# EAGLE schematic Esp_4relay_feedback (EAGLE 6.1)

## Sheet 1 of 3
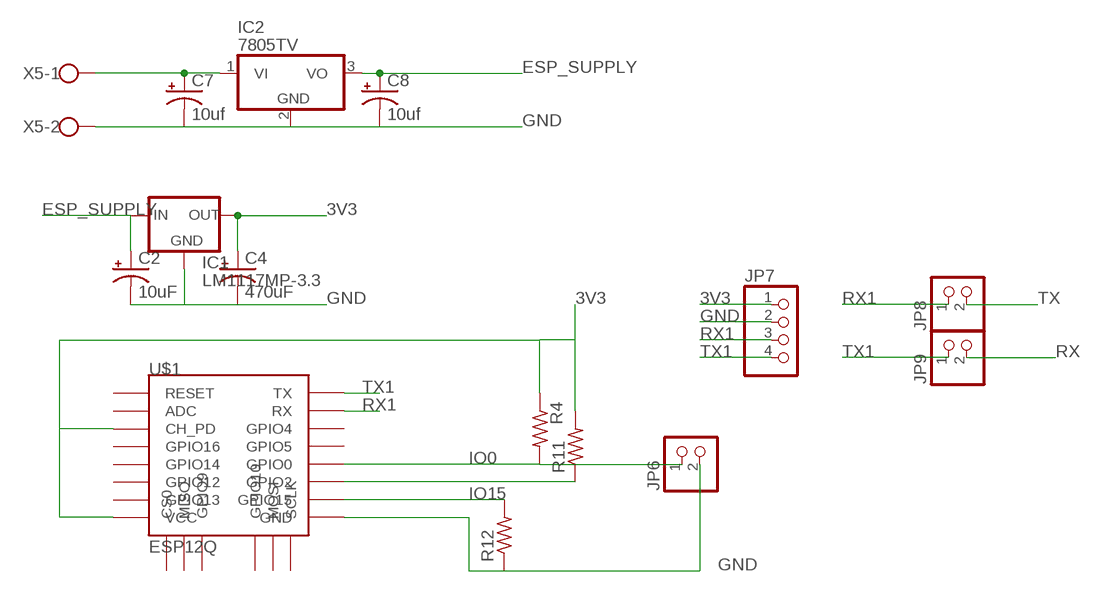
[diagram p0: schematic, sheet 1]

### Parts
C2  10uF  CPOL-USE2.5-6  [E2,5-6]
C4  470uF  CPOL-USE5-8.5  [E5-8,5]
C7  10uf  CPOL-USE2.5-6  [E2,5-6]
C8  10uf  CPOL-USE2.5-6  [E2,5-6]
IC1  LM1117MP-3.3  [SOT223]
IC2  7805TV  [TO220V]
JP6  PINHD-1X2  [1X02]
JP7  PINHD-1X4  [1X04]
JP8  PINHD-1X2  [1X02]
JP9  PINHD-1X2  [1X02]
R4  R-US_0207/10  [0207/10]
R11  R-US_0207/10  [0207/10]
R12  R-US_0207/10  [0207/10]
U$1  ESP12Q  [ESP12Q]
X5  W237-102  [W237-102]

### Nets
3V3: C4.+ IC1.2(OUT) IC1.4(OUT) JP7.1 R4.1 R11.2 U$1.CH_PD U$1.VCC
ESP_SUPPLY: C2.+ C8.+ IC1.3(IN) IC2.3(VO)
GND: C2.- C4.- C7.- C8.- IC1.1(GND) IC2.2(GND) JP6.2 JP7.2 R12.1 U$1.GND X5.2 ; also sheet 2,3
IO0: JP6.1 R4.2 U$1.GPIO0
IO15: R12.2 U$1.GPIO15
N$21: R11.1 U$1.GPIO2
N$26: C7.+ IC2.1(VI) X5.1
RX: JP9.2 ; also sheet 2
RX1: JP7.3 JP8.1 U$1.RX
TX: JP8.2 ; also sheet 2
TX1: JP7.4 JP9.1 U$1.TX
Unconnected: U$1.ADC U$1.CS0 U$1.GPIO4 U$1.GPIO5 U$1.GPIO9 U$1.GPIO10 U$1.GPIO12 U$1.GPIO13 U$1.GPIO14 U$1.GPIO16 U$1.MISO U$1.MOSI U$1.RESET U$1.SCLK

## Sheet 2 of 3
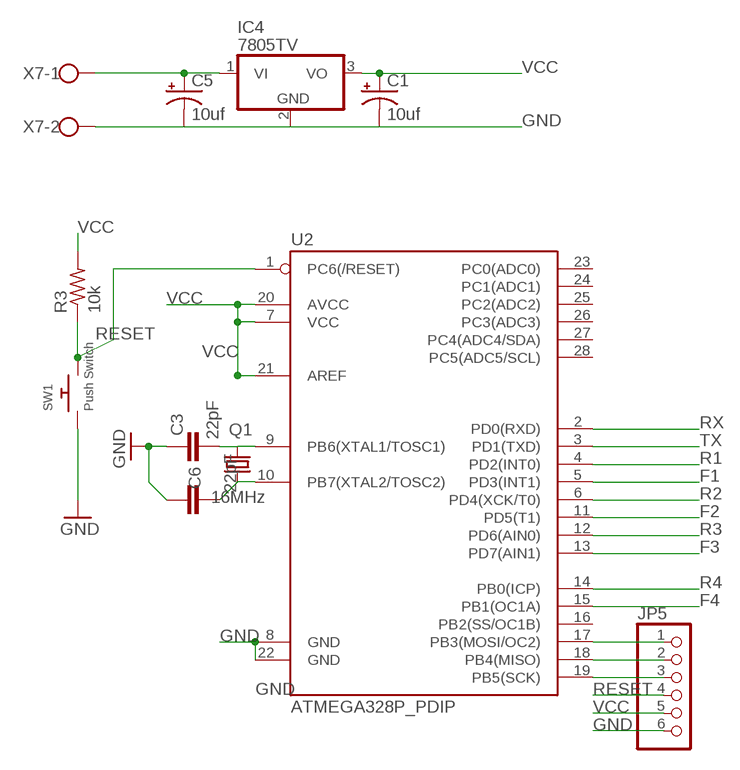
[diagram p1: schematic, sheet 2]

### Parts
C1  10uf  CPOL-USE2.5-6  [E2,5-6]
C3  22pF  CAPPTH  [CAP-PTH-SMALL]
C5  10uf  CPOL-USE2.5-6  [E2,5-6]
C6  22pF  CAPPTH  [CAP-PTH-SMALL]
IC4  7805TV  [TO220V]
JP5  PINHD-1X6  [1X06]
Q1  16MHz  CRYSTALHC49US  [HC49US]
R3  10k  R-US_0207/10  [0207/10]
SW1  Push Switch  SWITCH_PUSHBUTTONEVQ-PE  [TACT_PANA-EVQ]
U2  ATMEGA328P_PDIP  [DIL28-3]
X7  W237-102  [W237-102]

### Nets
F1: U2.5(PD3(INT1)) ; also sheet 3
F2: U2.11(PD5(T1)) ; also sheet 3
F3: U2.13(PD7(AIN1)) ; also sheet 3
F4: U2.15(PB1(OC1A)) ; also sheet 3
GND: C1.- C3.1 C5.- C6.1 IC4.2(GND) JP5.6 SW1.P$1 U2.8(GND) U2.22(GND) X7.2 ; also sheet 1,3
N$5: C3.2 Q1.2 U2.9(PB6(XTAL1/TOSC1))
N$10: C6.2 Q1.1 U2.10(PB7(XTAL2/TOSC2))
N$16: JP5.3 U2.19(PB5(SCK))
N$23: JP5.2 U2.18(PB4(MISO))
N$32: JP5.1 U2.17(PB3(MOSI/OC2))
N$33: C5.+ IC4.1(VI) X7.1
R1: U2.4(PD2(INT0)) ; also sheet 3
R2: U2.6(PD4(XCK/T0)) ; also sheet 3
R3: U2.12(PD6(AIN0)) ; also sheet 3
R4: U2.14(PB0(ICP)) ; also sheet 3
RESET: JP5.4 R3.1 SW1.P$2 U2.1(PC6(/RESET))
RX: U2.2(PD0(RXD)) ; also sheet 1
TX: U2.3(PD1(TXD)) ; also sheet 1
VCC: C1.+ IC4.3(VO) JP5.5 R3.2 U2.7(VCC) U2.20(AVCC) U2.21(AREF)
Unconnected: U2.16(PB2(SS/OC1B)) U2.23(PC0(ADC0)) U2.24(PC1(ADC1)) U2.25(PC2(ADC2)) U2.26(PC3(ADC3)) U2.27(PC4(ADC4/SDA)) U2.28(PC5(ADC5/SCL))

## Sheet 3 of 3
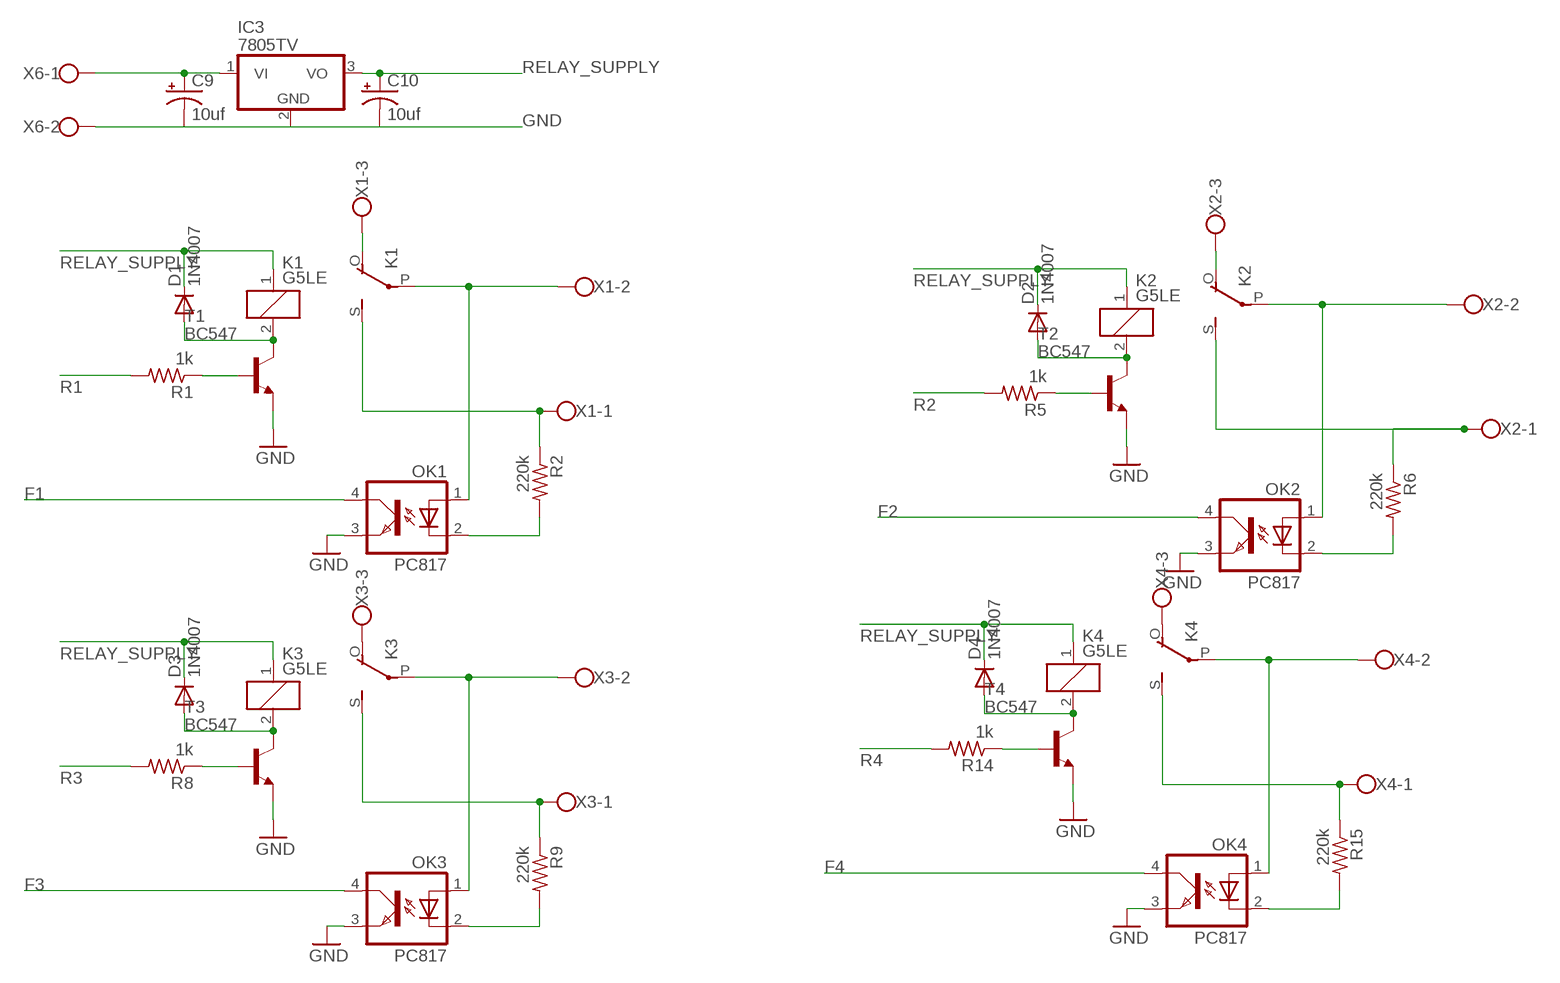
[diagram p2: schematic, sheet 3]

### Parts
C9  10uf  CPOL-USE2.5-6  [E2,5-6]
C10  10uf  CPOL-USE2.5-6  [E2,5-6]
D1  1N4007  1N4004  [DO41-10]
D2  1N4007  1N4004  [DO41-10]
D3  1N4007  1N4004  [DO41-10]
D4  1N4007  1N4004  [DO41-10]
IC3  7805TV  [TO220V]
K1  G5LE  [G5LE]
K2  G5LE  [G5LE]
K3  G5LE  [G5LE]
K4  G5LE  [G5LE]
OK1  PC817  [DIL04]
OK2  PC817  [DIL04]
OK3  PC817  [DIL04]
OK4  PC817  [DIL04]
R1  1k  R-US_0207/10  [0207/10]
R2  220k  R-US_0207/10  [0207/10]
R5  1k  R-US_0207/10  [0207/10]
R6  220k  R-US_0207/10  [0207/10]
R8  1k  R-US_0207/10  [0207/10]
R9  220k  R-US_0207/10  [0207/10]
R14  1k  R-US_0207/10  [0207/10]
R15  220k  R-US_0207/10  [0207/10]
T1  BC547  [TO92]
T2  BC547  [TO92]
T3  BC547  [TO92]
T4  BC547  [TO92]
X1  W237-103  [W237-103]
X2  W237-103  [W237-103]
X3  W237-103  [W237-103]
X4  W237-103  [W237-103]
X6  W237-102  [W237-102]

### Nets
F1: OK1.4(COL) ; also sheet 2
F2: OK2.4(COL) ; also sheet 2
F3: OK3.4(COL) ; also sheet 2
F4: OK4.4(COL) ; also sheet 2
GND: C9.- C10.- IC3.2(GND) OK1.3(EMIT) OK2.3(EMIT) OK3.3(EMIT) OK4.3(EMIT) T1.1(E) T2.1(E) T3.1(E) T4.1(E) X6.2 ; also sheet 1,2
N$1: K1.P(2:P) OK1.1(A) X1.2
N$2: OK1.2(C) R2.2
N$3: K1.S(2:S) R2.1 X1.1
N$4: K2.P(2:P) OK2.1(A) X2.2
N$6: K2.S(2:S) R6.1 X2.1
N$7: R1.1 T1.2(B)
N$8: D1.A K1.2 T1.3(C)
N$9: OK2.2(C) R6.2
N$11: R5.1 T2.2(B)
N$12: D2.A K2.2 T2.3(C)
N$13: K3.P(2:P) OK3.1(A) X3.2
N$14: K3.S(2:S) R9.1 X3.1
N$15: OK3.2(C) R9.2
N$17: R8.1 T3.2(B)
N$18: D3.A K3.2 T3.3(C)
N$19: K4.P(2:P) OK4.1(A) X4.2
N$20: K4.S(2:S) R15.1 X4.1
N$22: OK4.2(C) R15.2
N$24: R14.1 T4.2(B)
N$25: D4.A K4.2 T4.3(C)
N$27: C9.+ IC3.1(VI) X6.1
N$28: K1.O(2:O) X1.3
N$29: K2.O(2:O) X2.3
N$30: K3.O(2:O) X3.3
N$31: K4.O(2:O) X4.3
R1: R1.2 ; also sheet 2
R2: R5.2 ; also sheet 2
R3: R8.2 ; also sheet 2
R4: R14.2 ; also sheet 2
RELAY_SUPPLY: C10.+ D1.C D2.C D3.C D4.C IC3.3(VO) K1.1 K2.1 K3.1 K4.1

## Library data of the parts
C1 C2 C4 C5 C7-C10 = rcl:CPOL-US: POLARIZED CAPACITOR, American symbol
C3 C6 = SparkFun:CAP: Capacitor Standard 0603 ceramic capacitor, and 0.1" leaded capacitor.
D1-D4 = diode:1N4004: DIODE general purpose rectifier, 1 A
IC1 = lm1117_10:LM1117?-*: 800mA Low-Dropout Linear Regulator Source: http://www.ti.com/lit/ds/symlink/lm1117-n.pdf; MF: Texas Instruments; MPN: LM1117MP-3.3; OC_FARNELL: 9778195; OC_NEWARK: 28X3416
IC2-IC4 = linear:78*: Positive VOLTAGE REGULATOR Source: http://cache.national.com/ds/LM/LM78L05.pdf http://www.fairchildsemi.com/ds/LM/LM7805.pdf
JP5 = pinhead:PINHD-1X6: PIN HEADER
JP6 JP8 JP9 = pinhead:PINHD-1X2: PIN HEADER
JP7 = pinhead:PINHD-1X4: PIN HEADER
K1-K4 = relay:G5LE: RELAY 1 x switch, 10 A/120 V AC, 8 A/30 V DC, Omron; OC_FARNELL: unknown; OC_NEWARK: unknown
OK1-OK4 = optocoupler:PC817: SHARP OPTO COUPLER; MPN: PC817X4J000F; OC_FARNELL: 9707727; OC_NEWARK: 97K7059
Q1 = SparkFun:CRYSTAL: Crystals Various standard crystals. Proven footprints. Spark Fun Electronics SKU : COM-00534
R1 R2 R4-R6 R8 R9 R11 R12 R14 R15 = rcl:R-US_: RESISTOR, American symbol
R3 = resistor:R-US_: RESISTOR, American symbol
SW1 = adafruit:SWITCH_PUSHBUTTON: Buttons SOFTTOUCHSMD_SJ - Soft touch temporary push button (Super Junk Akihabara) Compatible with SKPMANE010 [Mouser: 688-SKPMAN] C&K_KSS = Digikey: KSS221GLFS
T1-T4 = transistor:BC547: NPN TRANSISTOR
U2 = SparkFun-DigitalIC:ATMEGA328P_PDIP: uC used in the Arduino 32kb flash, 1k EEPROM, 2k SRAM This is the through-hole version of this chip.
U$1 = esp826612q:ESP12Q: ESP8266 Wifi module 12-Q
X1-X4 = con-wago-500:W237-103: WAGO SCREW CLAMP; MPN: 237-103; OC_FARNELL: unknown; OC_NEWARK: 18M7116
X5-X7 = con-wago-500:W237-102: WAGO SCREW CLAMP; MPN: 237-102; OC_FARNELL: unknown; OC_NEWARK: 70K9898